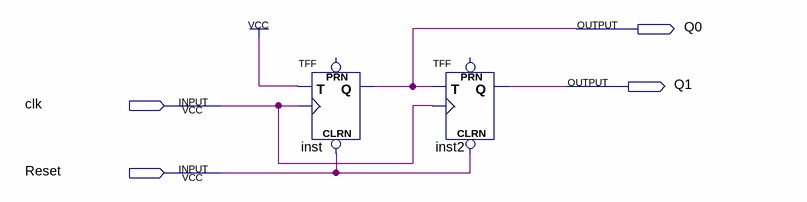
[diagram p0: schematic sheet]
// Quartus schematic Contador.bdf as structural Verilog: 2 symbols, 4 pins
module Contador (
  input  clk,
  input  Reset,
  output Q0,
  output Q1
);

  TFF inst (.CLRN(Reset), .T(1'b1), .CLK(clk), .Q(Q0));  // open: PRN
  TFF inst2 (.CLRN(Reset), .T(Q0), .CLK(clk), .Q(Q1));  // open: PRN
endmodule
